# EAGLE design Adafruit VL530X STEMMA QT (EAGLE 9.6.2)
COMPANY: ADAFRUIT INDUSTRIES; DRAWN: KTOWN; REV: A
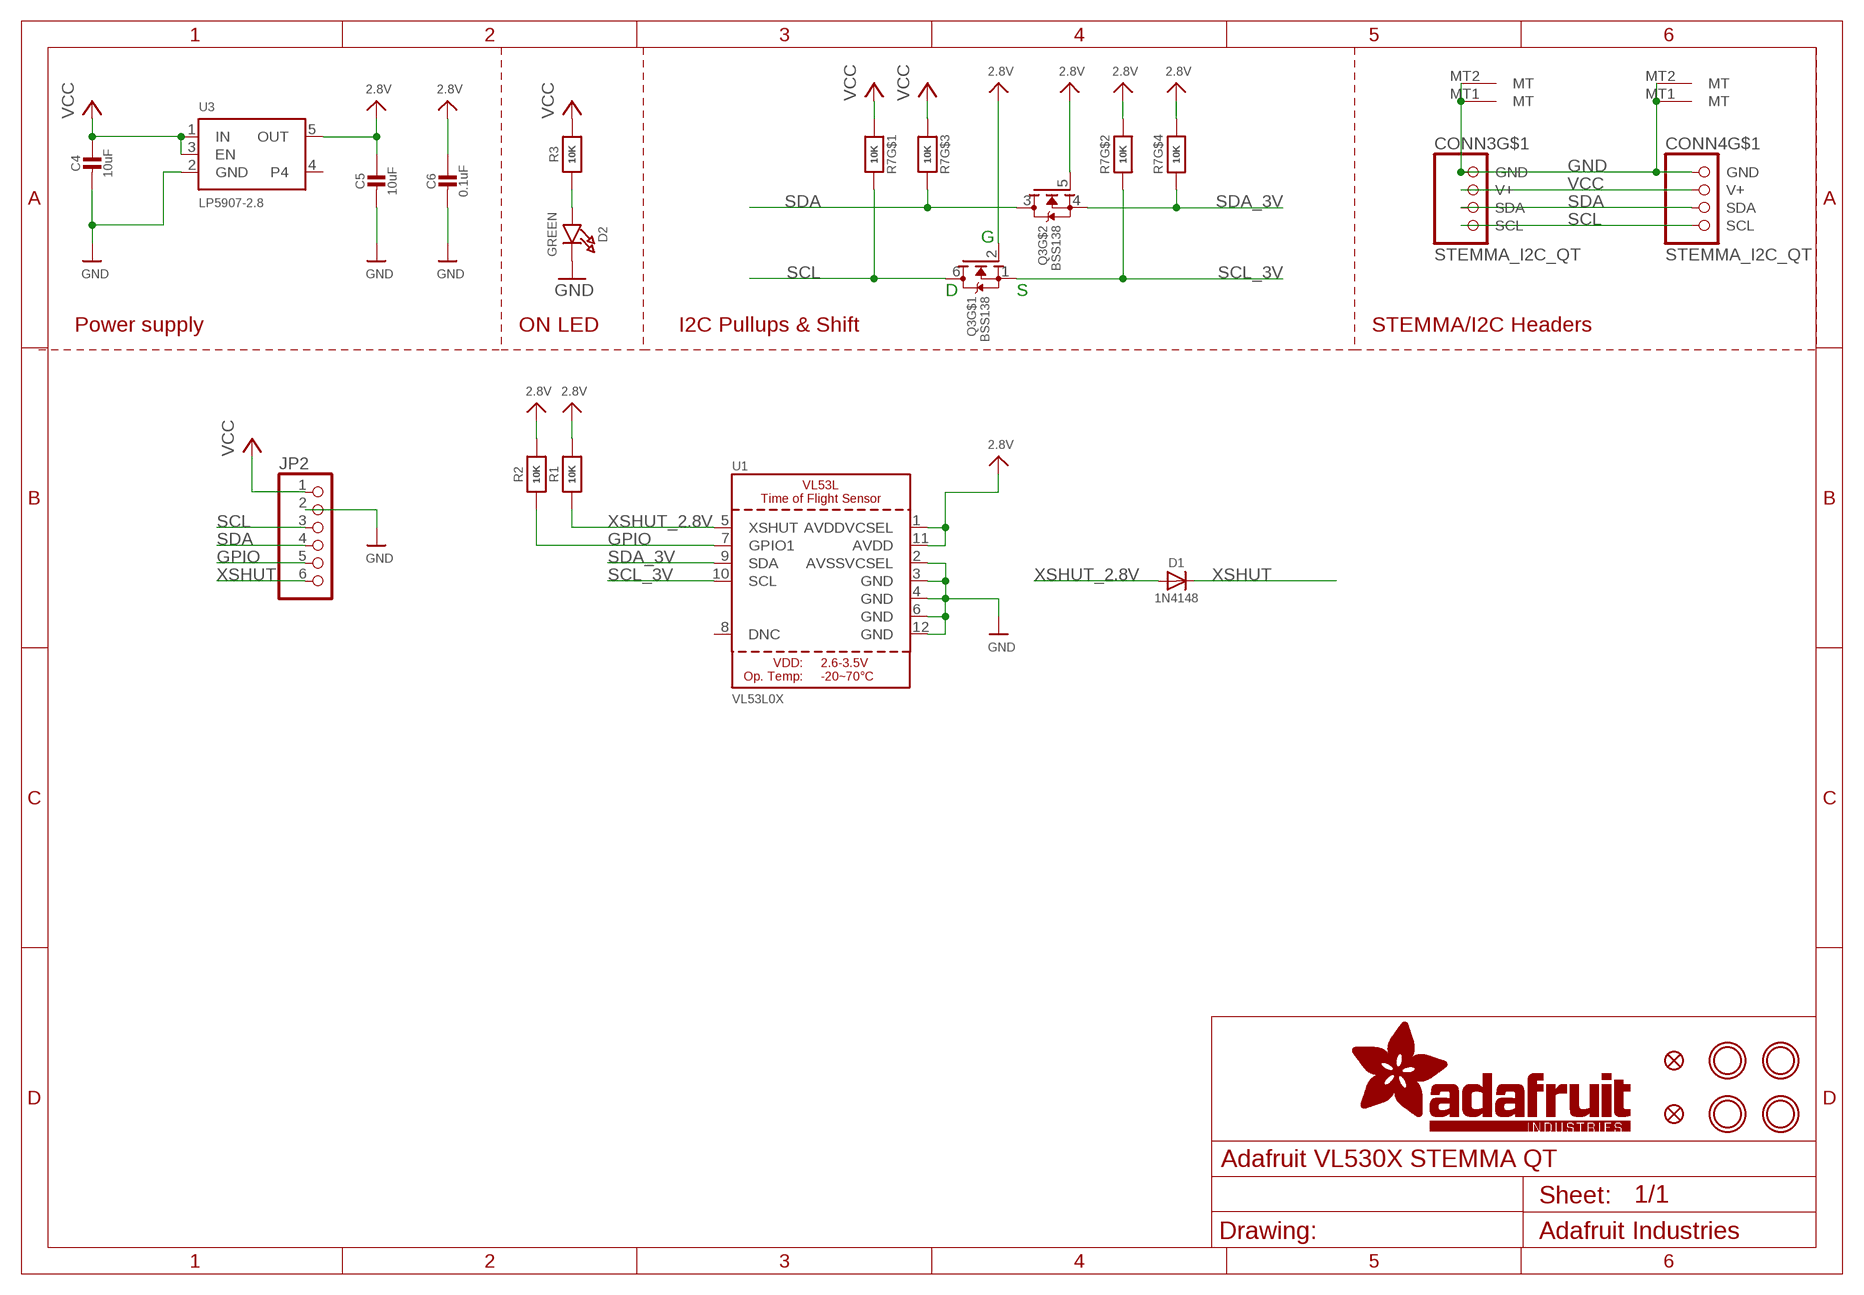
[diagram p0: schematic, sheet 1]

## Parts
C4  10uF  CAP_CERAMIC0805-NOOUTLINE  [0805-NO]
C5  10uF  CAP_CERAMIC0805-NOOUTLINE  [0805-NO]
C6  0.1uF  CAP_CERAMIC0603_NO  [0603-NO]
CONN3  STEMMA_I2C_QT  [JST_SH4]
CONN4  STEMMA_I2C_QT  [JST_SH4]
D1  1N4148  DIODESOD-323  [SOD-323]
D2  GREEN  LED0603_NOOUTLINE  [CHIPLED_0603_NOOUTLINE]
FID1  FIDUCIAL_1MM  [FIDUCIAL_1MM]
FID4  FIDUCIAL_1MM  [FIDUCIAL_1MM]
JP2  HEADER-1X670MIL  [1X06_ROUND_70]
Q3  BSS138  MOSFET-N_DUAL  [SOT363]
R1  10K  RESISTOR_0603_NOOUT  [0603-NO]
R2  10K  RESISTOR_0603_NOOUT  [0603-NO]
R3  10K  RESISTOR_0603_NOOUT  [0603-NO]
R7  10K  RESISTOR_4PACK  [RESPACK_4X0603]
U1  VL53L0X  [LGA12_ST]
U3  LP5907-2.8  VREG_SOT23-5  [SOT23-5]
U$30  MOUNTINGHOLE2.5  [MOUNTINGHOLE_2.5_PLATED]
U$31  MOUNTINGHOLE2.5  [MOUNTINGHOLE_2.5_PLATED]
U$33  MOUNTINGHOLE2.5  [MOUNTINGHOLE_2.5_PLATED]
U$34  MOUNTINGHOLE2.5  [MOUNTINGHOLE_2.5_PLATED]

## Nets
2.8V: C5.1 C6.1 Q3.2(G) Q3.5(G) R1.2 R2.2 R7.2 R7.4 U1.1(AVDDVCSEL) U1.11(AVDD) U3.5(OUT)
GND: C4.2 C5.2 C6.2 CONN3.1(GND) CONN3.MT1(MT) CONN3.MT2(MT) CONN4.1(GND) CONN4.MT1(MT) CONN4.MT2(MT) D2.C JP2.2 U1.2(AVSSVCSEL) U1.3(GND) U1.4(GND) U1.6(GND) U1.12(GND) U3.2(GND)
GPIO: JP2.5 R2.1 U1.7(GPIO1)
N$1: D2.A R3.1
SCL: CONN3.4(SCL) CONN4.4(SCL) JP2.3 Q3.6(D) R7.8
SCL_3V: Q3.1(S) R7.7 U1.10(SCL)
SDA: CONN3.3(SDA) CONN4.3(SDA) JP2.4 Q3.3(D) R7.6
SDA_3V: Q3.4(S) R7.5 U1.9(SDA)
VCC [highpower]: C4.1 CONN3.2(V+) CONN4.2(V+) JP2.1 R3.2 R7.1 R7.3 U3.1(IN) U3.3(EN)
XSHUT: D1.C JP2.6
XSHUT_2.8V: D1.A R1.1 U1.5(XSHUT)
Unconnected: U1.8(DNC) U3.4

## Notes on the sheet
- G
- D | S
- Power supply | ON LED | I2C Pullups & Shift | STEMMA/I2C Headers

## Library data of the parts
C4-C6 = microbuilder:CAP_CERAMIC: Ceramic Capacitors For new designs, use the packages preceded by an '_' character since they are more reliable: The following footprints should be used on most boards: _0402 - Standard footprint for regular board layouts _0603 - Standard footprint for regular board layouts _0805 - Standard footprint for regular board layouts _1206 - Standard footprint for regular board layouts For extremely tight-pitch boards where space is at a premium, the following 'micro-pitch' footprints can be used (smaller pads, no silkscreen outline, etc.): _0402MP - Micro-pitch footprint for very dense/compact boards _0603MP - Micro-pitch footprint for very dense/compact boards _0805MP - Micro-pitch footprint for very dense/compact boards _1206MP - Micro-pitch footprint for very dense/compact boards
CONN3 CONN4 = microbuilder:STEMMA_I2C
D1 = microbuilder:DIODE: Diode SMA Model Volts Amps Type Vf Ir Digikey # Notes SSA34-E3 40V 3A Schottky 480mV @ 3A 200uA @ 40V SSA34-E3/61TGITR-ND CDBA120-G 20V 1A Schottky 500mV @ 1A 500uA @ 20V 641-1014-6-ND REEL MBRA210 10V 2A Schottky 350mV @ 2A 700uA @ 10V MBRA210LT3 SOD-123 Model Volts Amps Type Vf Ir Order # Notes BAT54T1G 30V 200mA Schottky 800mV @ 200mA 2uA @ 25V BAT54T1GOSTR-ND B0530W 30V 500mA Schottky 430mV @ 500mA 130uA @ 30V B0530W-FDICT-ND REEL MBR120 20V 1A Schottky 340mV @ 1A MBR120VLSFT1GOSCT-ND SOD-323 Model Volts Amps Type Vf Ir Order # Notes PMEG2005EJ 20V 500mA Schottky 355mV @ 500mA 568-4110-1-ND ZLLS410 10V 570mA Schottky 380mV @ 570mA ZLLS410CT-ND 1N4148WS 75V 150mA Silicon/Simple 1V 1N4148WSFSCT-ND REEL SOD-523 Model Volts Amps Type Vf Ir Order # Notes BAT54XV2 30V 200mA Schottky 0.8V @ 100mA BAT54XV2CT-ND TB751S 30V 30mA Schottky RB751S-40TE61CT-ND SOT23-R/W (R = Solder Paste/Reflow Ovens, W = Hand-Soldering) Model Volts Amps Type Vf Ir Order # Notes BAT54FILM 40V 300mA Schottky 497-7162-1-ND POWERDI-5 Model Volts Amps Type Vf Ir Order # Notes PDS560 60V 5A Schottky 670mV @ 5A 150uA @ 60V PDS560DICT-ND
D2 = microbuilder:LED: LED 0603 - 0603 Surface Mount Package 2mA: Green LED - Low Power (3.9mcd, 2ma, 1.7Vf) - Digikey: 475-2709-2-ND Orange LED - Low Power (9.8mcd, 2ma, 1.8Vf) - Digikey: 475-1194-2-ND Red LED - Low Power (5mcd, 2ma, 1.8Vf) - Digikey: 475-1195-2-ND Yellow LED - Low Power (7mcd, 2ma, 1.8Vf) - Digikey: 475-1196-2-ND 5mA: Blue LED - Low Power (17mcd, 5ma, 2.9Vf) - Digikey: LNJ937W8CRACT-ND 0805 - 0805 Surface Mount Package 2mA: Red LED (8.8mcd, 2mA, 1.8Vf, Clear) - Low Power [Digikey: 475-2510-1-ND] Green LED (5mcd, 2mA, 1.8Vf, Clear) - Low Power [Digikey: 475-2730-1-ND] Yellow LED (11.3mcd, 2mA, 1.8Vf, Clear) - Low Power [Digikey: 475-2555-1-ND] 20mA: Red LED (104mcd, 20mA, Diffused) - LS R976 [Digikey: 475-1278-6-ND] Red LED (12mcd, 20mA, 2.0Vf, Clear) - APT2012EC [Digikey: 754-1128-1-ND] Green LED (15mcd, 20mA, 2.2Vf, Clear) - APT2012GC [Digikey: 754-1131-1-ND] Orange LED (160mcd, 20mA, 2.1Vf, Clear) - APT2012SECK [Digikey: 754-1130-1-ND] 1206 - 1206 Surface Mount Package Green LED (26mcd, 20mA, Diffused) - LG N971 [Digikey: 475-1407-6-ND] Red LED (15mcd, 20mA, Diffused) - LH N974 [Digikey: 475-1416-6-ND] Cree - Cree High-Power Surface Mount LEDs XPEBWT-L1-0000-00D50 - White 111lm 350mA 2.9Vf 6200K 110° XTEAWT-00-0000-00000LEE3 - White 114lm 350mA 2.85Vf 5000K 115° Everlight - Everlight 45-21 Series Surface Mount LEDs 45-21/QK2C-B2832AC2CB2/2T - Warm White 2000mcd 20mA 3.25Vf 3050K 120° 45-21/LK2C-B38452C4CB2/2T - Nuetral White 2000mcd 20mA 3.25Vf 4150K 120° 45-21/LK2C-B50634C6CB2/2T - Cold White 2200mcd 20mA 3.25Vf 5650K 120° PLCC2 Reverse Mount LS T77K-J1L2-1-0-2-R18-Z - Red 11.25mcd 2mA 1.8Vf 630nm 120° LO T77K-L1M2-24-Z - Orange 19.6mcd 2mA 1.8Vf 606nm 120° LY T77K-K2M1-26-Z - Yellow 15.7mcd 2mA 1.8Vf 587nm 120°
FID1 FID4 = microbuilder:FIDUCIAL: Fiducial Alignment Points Various fiducial points for machine vision alignment.; BOM: EXCLUDE
JP2 = microbuilder:HEADER-1X6: PIN HEADER
Q3 = microbuilder:MOSFET-N_DUAL: Dual N-Channel MOSFET SOT363 (2.0x1.25mm) 2N7002PS - 60V, 320mA [Digikey: 568-5984-1-ND]
R1-R3 = microbuilder:RESISTOR: Resistors For new designs, use the packages preceded by an '_' character since they are more reliable: The following footprints should be used on most boards: _0402 - Standard footprint for regular board layouts _0603 - Standard footprint for regular board layouts _0805 - Standard footprint for regular board layouts _1206 - Standard footprint for regular board layouts For extremely tight-pitch boards where space is at a premium, the following 'micro-pitch' footprints can be used (smaller pads, no silkscreen outline, etc.): _0402MP - Micro-pitch footprint for very dense/compact boards _0603MP - Micro-pitch footprint for very dense/compact boards _0805MP - Micro-pitch footprint for very dense/compact boards _1206MP - Micro-pitch footprint for very dense/compact boards
R7 = microbuilder:RESISTOR_4PACK: Resistor Packs (4 resistors) 4 x 0603 10K 1/16W - Digikey: YC164J-10KCT-ND
U1 = microbuilder:VL53L0X: VL53L0X - Laser Time of Flight Sensor (2M range)
U3 = microbuilder:VREG_SOT23-5: SOT23-5 Fixed Voltage Regulators Part Current Out V Out V In V Dropout θJA (°C/W) TJ (°C) Digikey Part No. ADP121 150mA 3.3V 3.4-5.5V 0.09V @ 150mA -- -- ADP121-AUJZ33R7CT-ND ADP121 150mA 3.0V 3.1-5.5V 0.09V @ 150mA -- -- ADP121-AUJZ30R7CT-ND ADP122 300mA 3.3V 3.4-5.5V 0.085V @ 300mA -- -- ADP122AUJZ-3.3-R7CT-ND ADP1712 300mA 3.3V 3.5-5.5V 0.17V @ 300mA -- -- ADP1712AUJZ-3.3-R7TR-ND AP7311 (Low Cost) 150mA 3.3V 3.5-6V 0.15V @ 150mA -- -- AP7311-33WG-7DICT-ND LD39015M18R 150mA 1.8V 1.9V-5.5V 0.08V @ 100mA -- -- 497-6977-1-ND LP2985A-33DBVR 150mA 3.3V 3.3-16V 0.28V @ 150mA 206 150 296-18479-1-ND MCP1824T-3302E/OT 300mA 3.3V 3.5V-6V 0.2V @ 300mA -- -- MCP1824T-3302E/OTCT-ND MIC5205-2.5YM5 TR 150mA 2.5V 2.7-16V 0.165V @ 150mA -- -- 576-1257-2-ND MIC5205-3.0YM5 TR 150mA 3.0V 3.2V-16V 0.165V @ 150mA -- -- 576-1258-2-ND MIC5205-3.3YM5 TR 150mA 3.3V 3.5V-16V 0.165V @ 150mA -- -- 576-1259-2-ND TPS780330220 150mA 3.3V+2.2V 3.6-5.5V 250mV Max -- -- 296-23332-1-ND TDA3663/N1,135 100mA 3.3V 3.5-45V 0.18V @ 50mA -- -- 568-5343-1-ND Max operating temp can be calculated using θJA, TJ (max junction temperature), and power in watts. Set the "Maximum Ambient Temperature" until it reaches TJ ("Max Junction Temperature"), which is the absolute limit for safe use of the regulator: Heat Sink Temperature Calculator <http://www.daycounter.com/Calculators/Heat-Sink-Temperature-Calculator.phtml> For example, With 12V source into a 3.3V LP2985 and a 30mA load, we are dissipating (12V-3.3V) * 0.03A = 0.261W. With a θJA of 206 °C/W, a TJ of 150°C, and 261mW we can safely use the chip without a heat sink up to 75°C (=147.1°C Junction Temperature).
U$30 U$31 U$33 U$34 = microbuilder:MOUNTINGHOLE: Mounting Hole For #2 screws (0.086"/2.18mm width, 0.094"/2.4mm hole) use 2.5mm; BOM: EXCLUDE

## Net classes
1 highpower: width 0.406 mm, drill 0.483 mm
2 lowpower: width 0.305 mm, drill 0.483 mm

## Board
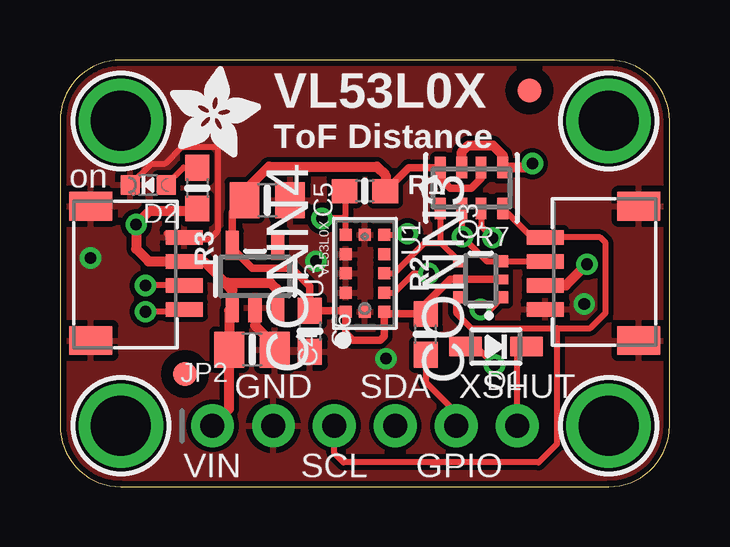
[diagram p1: board, top side]
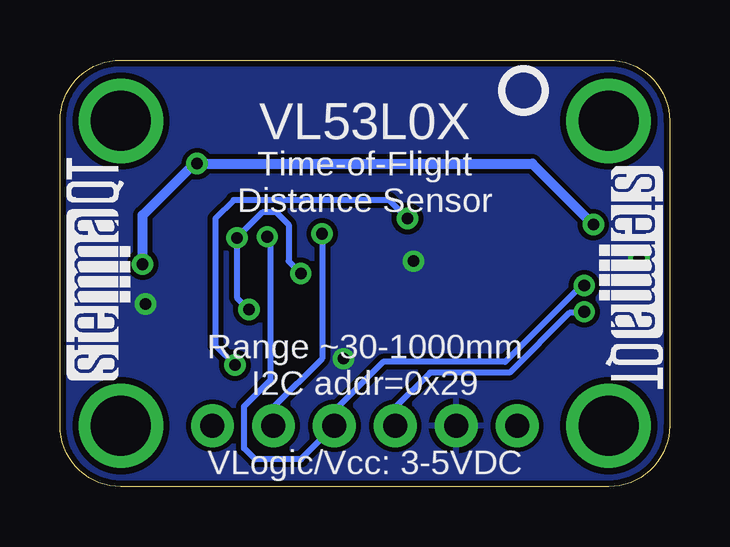
[diagram p2: board, bottom side, seen from below]

Size 25.4 x 17.78 mm. Coordinates in mm from the lower left corner, seen from the top.
Outline: 0,15.24 0,2.54 arc90 2.54,0 22.86,0 arc90 25.4,2.54 25.4,15.24 arc90 22.86,17.78 2.54,17.78 arc90 0,15.24
Copper layers (1*16): Top 0.035mm / dielectric 1.5mm / Bottom 0.035mm
Design rules "adafruit *": minimum track width 8mil, minimum drill 15.5mil, track to track 8mil, track to pad 8mil, pad to pad 8mil, via to via 8mil, smd to smd 8mil, copper to edge 10mil, drill to drill 8mil, minimum pad ring 10mil, minimum via ring 8mil, stop-mask expansion 2mil, vias tented up to drill 20mil, thermal gap 10mil

### Footprints (pad centres in the part's own frame; a part is rotated, then mirrored left to right if it is on the bottom)
0805-NO = smd 1.24 x 1.5: 1 -0.95,0; 2 0.95,0
0603-NO = smd 1.075 x 1: 1 -0.85,0; 2 0.85,0
JST_SH4 = smd 0.6 x 1.55: 1 -1.5,2.514; 2 -0.5,2.514; 3 0.5,2.514; 4 1.5,2.514 | smd 1.2 x 1.8: MT1 -2.8,-1.386; MT2 2.8,-1.386
SOD-323 = smd 1.35 x 0.8: A 1.27,0; C -1.27,0
CHIPLED_0603_NOOUTLINE = smd 0.8 x 0.8: A 0,-0.75; C 0,0.75
FIDUCIAL_1MM = smd 1 x 1: 1 0,0
1X06_ROUND_70 = drill 1 pad 1.778: 1 -6.35,0; 2 -3.81,0; 3 -1.27,0; 4 1.27,0; 5 3.81,0; 6 6.35,0
SOT363 = smd 0.5 x 0.5: 1 -0.75,-0.9; 3 0.75,-0.9; 4 0.75,0.9; 6 -0.75,0.9 | smd 0.4 x 0.5: 2 0,-0.9; 5 0,0.9
RESPACK_4X0603 = smd 0.45 x 0.9: 1 -1.3,-0.85; 2 -0.4,-0.85; 3 0.4,-0.85; 4 1.3,-0.85; 5 1.3,0.85; 6 0.4,0.85; 7 -0.4,0.85; 8 -1.3,0.85
LGA12_ST = smd 0.5 x 0.5: 1 1.6,-0.8; 2 0.8,-0.8; 3 0,-0.8; 4 -0.8,-0.8; 5 -1.6,-0.8; 6 -1.6,0; 7 -1.6,0.8; 8 -0.8,0.8; 9 0,0.8; 10 0.8,0.8; 11 1.6,0.8; 12 1.6,0
SOT23-5 = smd 0.55 x 1.2: 1 -0.95,-1.3; 2 0,-1.3; 3 0.95,-1.3; 4 0.95,1.3; 5 -0.95,1.3
MOUNTINGHOLE_2.5_PLATED = drill 2.5 pad 3.2: P$1 0,0

### Placement (x,y rotation side)
C4  8,5.71 0 top
C5  8.64,11.94 0 top
C6  10.41,6.48 270 top
CONN3  22.73,8.89 90 top
CONN4  2.67,8.89 270 top
D1  18.16,5.84 180 top
D2  3.68,12.57 90 top
FID1  5.21,4.7 0 top
FID4  19.56,16.51 0 top
JP2  12.7,2.54 0 top
Q3  17.53,8.64 90 top
R1  12.7,12.32 0 top
R2  15.24,6.35 90 top
R3  5.71,12.45 270 top
R7  17.14,12.45 180 top
U1  12.7,8.89 270 top
U3  8.13,8.76 0 top
U$30  2.54,15.24 0 top
U$31  22.86,15.24 0 top
U$33  2.54,2.54 0 top
U$34  22.86,2.54 0 top
U$36  [ADAFRUIT_3.5MM]  4.57,13.72 0 top
U$37  [PCBFEAT-REV-040]  6.1,16.51 0 bottom
U$38  [STEMMAQT]  22.48,4.45 90 bottom
U$39  [STEMMAQT]  2.92,13.34 270 bottom

### Tracks (layer width: path | path; a pad name or v marks a point on that pad's centre or on a via)
2.8V
  Top 0.305: C5.1 7.18,11.43 U3.5 7.18,9.94 8.01,9.11 9.65,9.11 10.41,8.35 C6.1 11.86,7.33 U1.1 11.9,6.39 12.19,6.1 13.34,6.1 13.5,6.26 U1.11 13.59,7.2 15.11,7.2 | 15.11,7.2 R2.2 | Q3.2 Q3.5 16.26,8.64 15.11,7.49 15.11,7.2 | R7.2 17.55,12.85 17.14,12.45 16.26,12.45 15.85,12.86 R7.4 14.53,13.3 13.57,12.34 R1.2
  Top 0.406: C5.1 7.69,12.32 8.7,13.34 13.21,13.34 13.57,12.97 13.57,12.34
GND  (via drill 0.48)
  Top 0.254: D2.C 3.82,13.46 4.38,13.46 5.08,14.16 6.57,14.16 6.57,10.64 6.22,10.29 4.7,10.29 4.45,10.54 5.03,10.54 CONN4.1
  Top 0.406: U3.2 8.13,6.71 8.95,5.89 C4.2
  other vias: 13.59,5.33 10.67,9.4 1.27,9.53 21.84,7.62
  pour Top: 0,17.78 25.4,17.78 25.4,0 0,0
  pour Bottom: 0,17.78 25.4,17.78 25.4,0 0,0
GPIO  (via drill 0.48)
  Top 0.254: R2.1 15.24,4.36 16.51,3.09 JP2.5 | U1.7 14.43,10.49 v14.48,10.54
  Bottom 0.254: v14.48,10.54 14.48,5.33 16.51,3.3 JP2.5
N$1
  Top 0.254: D2.A 5.16,13.3 R3.1
SCL  (via drill 0.48)
  Top 0.254: CONN4.4 5.08,7.29 v3.56,7.29 | R7.8 19.65,10.39 CONN3.4 22.5,10.39 22.73,10.16 22.73,7.24 22.1,6.6 20.7,6.6 | Q3.6 16.5,7.76 16.5,7.25 17.14,6.6 20.7,6.6 | 20.7,6.6 20.7,1.78 19.94,1.02 11.81,1.02 11.43,1.4 JP2.3
  Bottom 0.254: v3.56,7.29 3.61,7.24 4.18,7.24 6.67,4.75 9.98,4.75 11.43,3.3 JP2.3
SCL_3V  (via drill 0.48)
  Top 0.254: R7.7 17.55,10.86 v18.03,10.37 | v17.53,7.38 17.92,7.38 Q3.1 | U1.10 13.93,8.09 14.73,8.89 v15.37,8.89
  Bottom 0.254: v17.53,7.38 18.03,7.88 v18.03,10.37 16.97,11.43 16.38,11.43 15.88,10.92 15.88,9.4 v15.37,8.89
SDA  (via drill 0.48)
  Top 0.254: CONN4.3 v3.56,8.39 v3.56,8.38 | Q3.3 | Q3.3 CONN3.3 | R7.6 16.75,10.43 v16.76,10.41 17.79,9.39 Q3.3
  Bottom 0.254: v3.56,8.38 3.68,8.38 6.86,5.21 11.94,5.21 13.97,3.17 JP2.4 15.37,1.14 17.27,1.14 17.73,1.6 17.73,3.35 16.64,4.45 16.64,10.03 16.76,10.16 v16.76,10.41
SDA_3V
  Top 0.254: R7.5 15.85,10.17 | 15.85,10.17 Q3.4 | U1.9 13.92,8.89 15.2,10.17 15.85,10.17
VCC  (via drill 0.48)
  Top 0.406: JP2.1 7.05,3.24 C4.1 7.05,7.34 U3.1 7.18,8.19 6.92,8.45 | 6.92,8.45 6.99,8.51 8.76,8.51 9.02,8.26 9.02,7.52 U3.3 | 6.92,8.45 5.98,9.39 CONN4.2 3.69,9.39 3.17,9.91 v3.17,10.92 3.72,11.47 5.59,11.47 R3.2 | R7.3 16.75,13.95 17.02,14.22 18.03,14.22 18.45,13.81 R7.1 19.52,13.3 v19.68,13.46 | CONN3.2 21.08,8.39 v21.96,9.27
  Bottom 0.406: v21.96,9.27 21.96,11.32 19.81,13.46 v19.68,13.46 5.71,13.46 v3.17,10.92
XSHUT
  Top 0.254: JP2.6 19.05,5.46 D1.C
XSHUT_2.8V  (via drill 0.48)
  Top 0.254: U1.5 11.9,11.3 | 11.9,11.3 11.9,12.27 R1.1 | 11.9,11.3 11.77,11.18 v10.92,11.18 | v18.11,5.07 17.33,5.84 D1.A
  Bottom 0.254: v10.92,11.18 11.68,11.94 18.16,11.94 18.92,11.18 18.92,5.88 v18.11,5.07

### Text on the board
tPlace: VL53L0X | ToF Distance | on | GND | SDA | XSHUT | VIN | SCL | GPIO
bPlace: VL53L0X | Time-of-Flight / Distance Sensor | Range ~30-1000mm / I2C addr=0x29 | VLogic/Vcc: 3-5VDC